# Altium schematic sheet Battery Measurement.SchDoc: Battery Measurement
size 292 x 193 mm; SheetNumber: 3; SheetTotal: 4
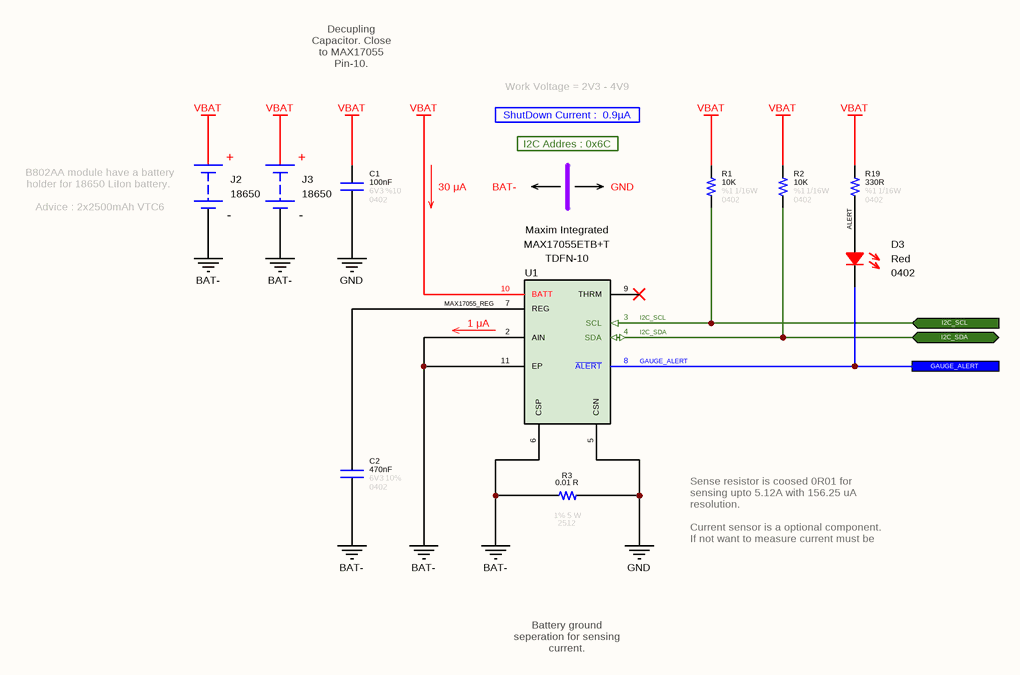
[diagram p0: Battery Measurement.SchDoc]

## Parts
C1  value 100nF  Tolerance: %10  Voltage: 6V3  Case: 0402  [CAPACITOR_0402]  (hidden comment: Capacitor - 100nF [0402] (Ceramic))
C2  value 470nF  Tolerance: 10%  Case: 0402  Voltage: 6V3  [CAPACITOR_0402]  (hidden comment: Capacitor - 470nF [0402] (Ceramic))
D3  Case: 0402  Color: Red  [LED_0402]  (hidden comment: SMD LED (Red))
J2  Battery Size: 18650  [BATTERY_HOLDER - Bat]  (hidden comment: 54)
J3  Battery Size: 18650  [BATTERY_HOLDER - Bat]  (hidden comment: 54)
R1  value 10K  Tolerance: %1  Case: 0402  Power: 1/16W  [RESISTOR_0402]  (hidden comment: 10K - 0402 - %1 - 1/16W)
R2  value 10K  Tolerance: %1  Case: 0402  Power: 1/16W  [RESISTOR_0402]  (hidden comment: 10K - 0402 - %1 - 1/16W)
R3  value 0.01 R  Tolerance: 1%  Power: 5 W  Case: 2512  [RESISTOR_2512 SHUNT]  (hidden comment: 0R01 - 2512 - %1 - 5W)
R19  value 330R  Case: 0402  Tolerance: %1  Power: 1/16W  [RESISTOR_0402]  (hidden comment: 330R - 0402 - %1 - 1/16W)
U1  Manufacturer Name: Maxim Integrated  [TDFN-10]  (hidden comment: MAX17055ETB+T)

## Ports
GAUGE_ALERT, I2C_SCL (in), I2C_SDA (bidir)

## Nets
BAT-: C2.1 J2.2(BAT-) J3.2(BAT-) R3.2 U1.2(AIN) U1.6(CSP) U1.11(EP)
GND: C1.1 R3.1 U1.5(CSN)
VBAT: C1.2 J2.1(BAT+) J3.1(BAT+) R1.2 R2.2 R19.2 U1.10(BATT)
ALERT: D3.2 R19.1
GAUGE_ALERT: D3.1 U1.8(~{ALERT}) ; port GAUGE_ALERT
I2C_SCL: R1.1 U1.3(SCL) ; port I2C_SCL
I2C_SDA: R2.1 U1.4(SDA) ; port I2C_SDA
MAX17055_REG: C2.2 U1.7(REG)

Not connected (* = marked no-connect by the designer): U1 9(THRM)*

## Notes on the sheet
- Decupling Capacitor. Close to MAX17055 Pin-10.
- ShutDown Current :  0.9µA
- Work Voltage = 2V3 - 4V9
- 30 μA
- I2C Addres : 0x6C
- BAT-
- GND
- (near J2) B802AA module have a battery holder for 18650 LiIon battery.
  Advice : 2x2500mAh VTC6
- (near U1) 1 μA
- Sense resistor is coosed 0R01 for sensing upto 5.12A with 156.25 uA resolution.
  Current sensor is a optional component. If not want to measure current must be connect PACK- to GND.
- Battery ground seperation for sensing current.
- © 2021 All rights reserved.
  This document may not, in whole or in part, be copied, photocopied, reproduced, translated or converted to any electronic or machine readable from without prior written permission of Mehmet Günce Akkoyun.
  Engineer contact : akkoyun@me.com
- Property of
- Engineer :
- Date :
- Size :
- A4
- Time :
- Project :
- Page :
- /
- Customer :
- Product ID :
- Module ID :
- Version :
- File :
- Revision :
- (in symbol Connector - 18650 Battery Holder) +; -

## Library data of the parts
C1 = Capacitor - 100nF [0402-6V3]: Capacitor - 100nF [0402-6V3] (Ceramic); Manufacturer Name: AVX; Manufacturer Part Number: 04026D104KAT4A; ComponentLink1Description: Mouser; ComponentLink1URL: https://www.mouser.com.tr/ProductDetail/AVX/04026D104KAT4A?qs=sGAEpiMZZMs0AnBnWHyRQPg4iYkCw7IMED%2F4kpqgf7w%3D; ComponentLink2Description: DataSheet; ComponentLink2URL: https://www.mouser.com.tr/datasheet/2/40/cx5r-776519.pdf
C2 = Capacitor - 470 nF [0402-6V3]: Multilayer Ceramic Capacitors - SMD - 6.3V 470nF X7R 0402 10%; Manufacturer Name: AVX; Manufacturer Part Number: 04026C474KAT2A
D3 = Diode - LED (0402-Red): Standard LEDs - SMD MINI-MOLD ULTRA COMPACT RED; Manufacturer Name: ROHM Semiconductor; Manufacturer Part Number: SML-P12VTT86R; ROHS: Yes; ComponentLink1Description: DataSheet; ComponentLink1URL: https://www.mouser.com.tr/datasheet/2/348/sml-p1-e-1139198.pdf; ComponentLink2Description: Mouser; ComponentLink2URL: https://www.mouser.com.tr/ProductDetail/ROHM-Semiconductor/SML-P12U2TT86R?qs=sGAEpiMZZMseGfSY3csMkRIBDsfU3UCXJTULB5gem9Ta%252Bp%252BvZ709fg%3D%3D
J2 J3 = Connector - 18650 Battery Holder: BATTERY CONTACT CLP 18650 PC PIN; Manufacturer Name: Keystone Electronics; Manufacturer Part Number: 54; Product Type: Battery Holders; RoHS: Yes
R1 R2 = Resistor - 10K [0402]: Thick Film Resistors - SMD 1/16 W 10 KOhm 1%; Manufacturer Name: Vishay; Manufacturer Part Number: CRCW040210K0FKED; ComponentLink1Description: DataSheet; ComponentLink1URL: https://www.mouser.com.tr/datasheet/2/427/dcrcwe3-1762152.pdf; ComponentLink2Description: Mouser; ComponentLink2URL: https://www.mouser.com.tr/ProductDetail/Vishay-Dale/CRCW040210K0FKED?qs=sGAEpiMZZMu61qfTUdNhG2DpbjADlD3GcalbOv9utCY%3D
R3 = Resistor - 0R01 [2512]: Shunt Resistors - SMD 5 W 0.01 Ohm 1%; Manufacturer Part Number: TLRH3APTTE10L0F; Manufacturer Name: KOA Speer
R19 = Resistor - 330R [0402]: Thick Film Resistors - SMD 1/16 W 330 Ohm 1%; Manufacturer Name: Vishay; Manufacturer Part Number: CRCW0402330RFKED; ComponentLink1Description: DataSheet; ComponentLink1URL: https://www.mouser.com.tr/datasheet/2/427/dcrcwe3-1762152.pdf; ComponentLink2Description: Mouser; ComponentLink2URL: https://www.mouser.com.tr/ProductDetail/Vishay-Dale/CRCW0402330RFKED?qs=sGAEpiMZZMu61qfTUdNhG2DpbjADlD3GGS6SwBlLi5Q%3D
U1 = IC - MAX17055: IC FUEL GAUGE MODELGAUGE 10TDFN; Minimum Operating Temperature: - 40 C; Product Type: Battery Gauge; Maximum Operating Temperature: + 85 C; Manufacturer Part Number: MAX17055ETB+T; Case: TDFN-10